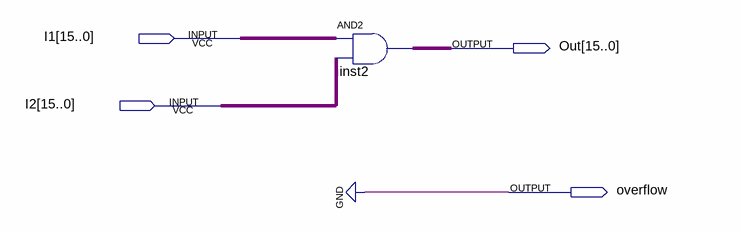
[diagram p0: schematic sheet]
// Quartus schematic 16bitsub2.bdf as structural Verilog: 1 symbols, 4 pins
module \16bitsub2  (
  input  [15:0] I1,
  input  [15:0] I2,
  output [15:0] Out,
  output overflow
);

  assign Out = I1 & I2;  // AND2 inst2, 16 bits wide

  assign overflow = 1'b0;
endmodule
